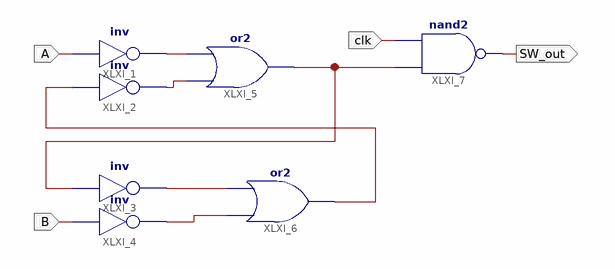
[diagram p0: schematic sheet 1]
// Xilinx ISE schematic FPGA_SENSOR.sch (spartan6) as structural Verilog: 7 symbols, 4 ports
module FPGA_SENSOR (
  input  A,
  input  B,
  input  clk,
  output SW_out
);

  wire XLXN_2, XLXN_3, XLXN_5, XLXN_6, XLXN_8, XLXN_10;

  not XLXI_1 (XLXN_2, A);
  not XLXI_2 (XLXN_3, XLXN_10);
  not XLXI_3 (XLXN_5, XLXN_8);
  not XLXI_4 (XLXN_6, B);
  or XLXI_5 (XLXN_8, XLXN_3, XLXN_2);
  or XLXI_6 (XLXN_10, XLXN_6, XLXN_5);
  nand XLXI_7 (SW_out, XLXN_8, clk);
endmodule
